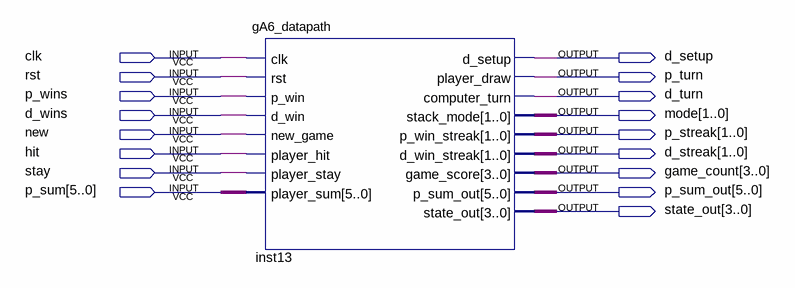
[diagram p0: schematic sheet]
// Quartus schematic Block3.bdf as structural Verilog: 1 symbols, 17 pins
module Block3 (
  input  clk,
  input  rst,
  input  p_wins,
  input  d_wins,
  input  \new ,
  input  hit,
  input  stay,
  input  [5:0] p_sum,
  output d_setup,
  output p_turn,
  output d_turn,
  output [1:0] mode,
  output [1:0] p_streak,
  output [1:0] d_streak,
  output [3:0] game_count,
  output [5:0] p_sum_out,
  output [3:0] state_out
);

  gA6_datapath inst13 (
    .clk(clk), .rst(rst), .p_win(p_wins), .d_win(d_wins), .new_game(\new ), .player_hit(hit),
    .player_stay(stay), .player_sum(p_sum), .d_setup(d_setup), .player_draw(p_turn), .computer_turn(d_turn),
    .stack_mode(mode), .p_win_streak(p_streak), .d_win_streak(d_streak), .game_score(game_count),
    .p_sum_out(p_sum_out), .state_out(state_out));
endmodule
